# Altium schematic sheet YSPI1050-100M1_YSPI1050-100M.schdoc
size 127 x 99 mm
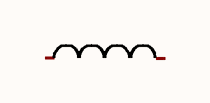
[diagram p0: YSPI1050-100M1_YSPI1050-100M.schdoc]

## Parts
L?  10uH  [IND-SMD_L11.5-W10.0_SMMS1040]  (value not drawn)

## Nets

Not connected (* = marked no-connect by the designer): L? 1 2

## Library data of the parts
L? = YSPI1050-100M: Manufacturer: YJYCOIN(益嘉源); Add into BOM: yes; Tolerance: ±20%; Rated Current: 6A; DC Resistance (DCR): 19.3mΩ; Symbol: YSPI1050-100M; Device: YSPI1050-100M; LCSC Part Name: 10uH ±20%; Supplier Part: C497897; Manufacturer Part: YSPI1050-100M; Supplier Footprint: SMD,11x10mm; JLCPCB Part Class: Extended Part; Datasheet: https://atta.szlcsc.com/upload/public/pdf/source/20240507/CDF618C6C30EFC34B42EA1108EE1A6A7.pdf; Supplier: LCSC; Convert to PCB: yes; Value: 10uH